# EasyEDA schematic SCH_touch_clock_2022-06-03.json
TITLE: Sheet_1; REV: 1.0; Date: 2021-07-16; Sheet: 1/1; Drawn By: hhzrbq; Company: Your Company
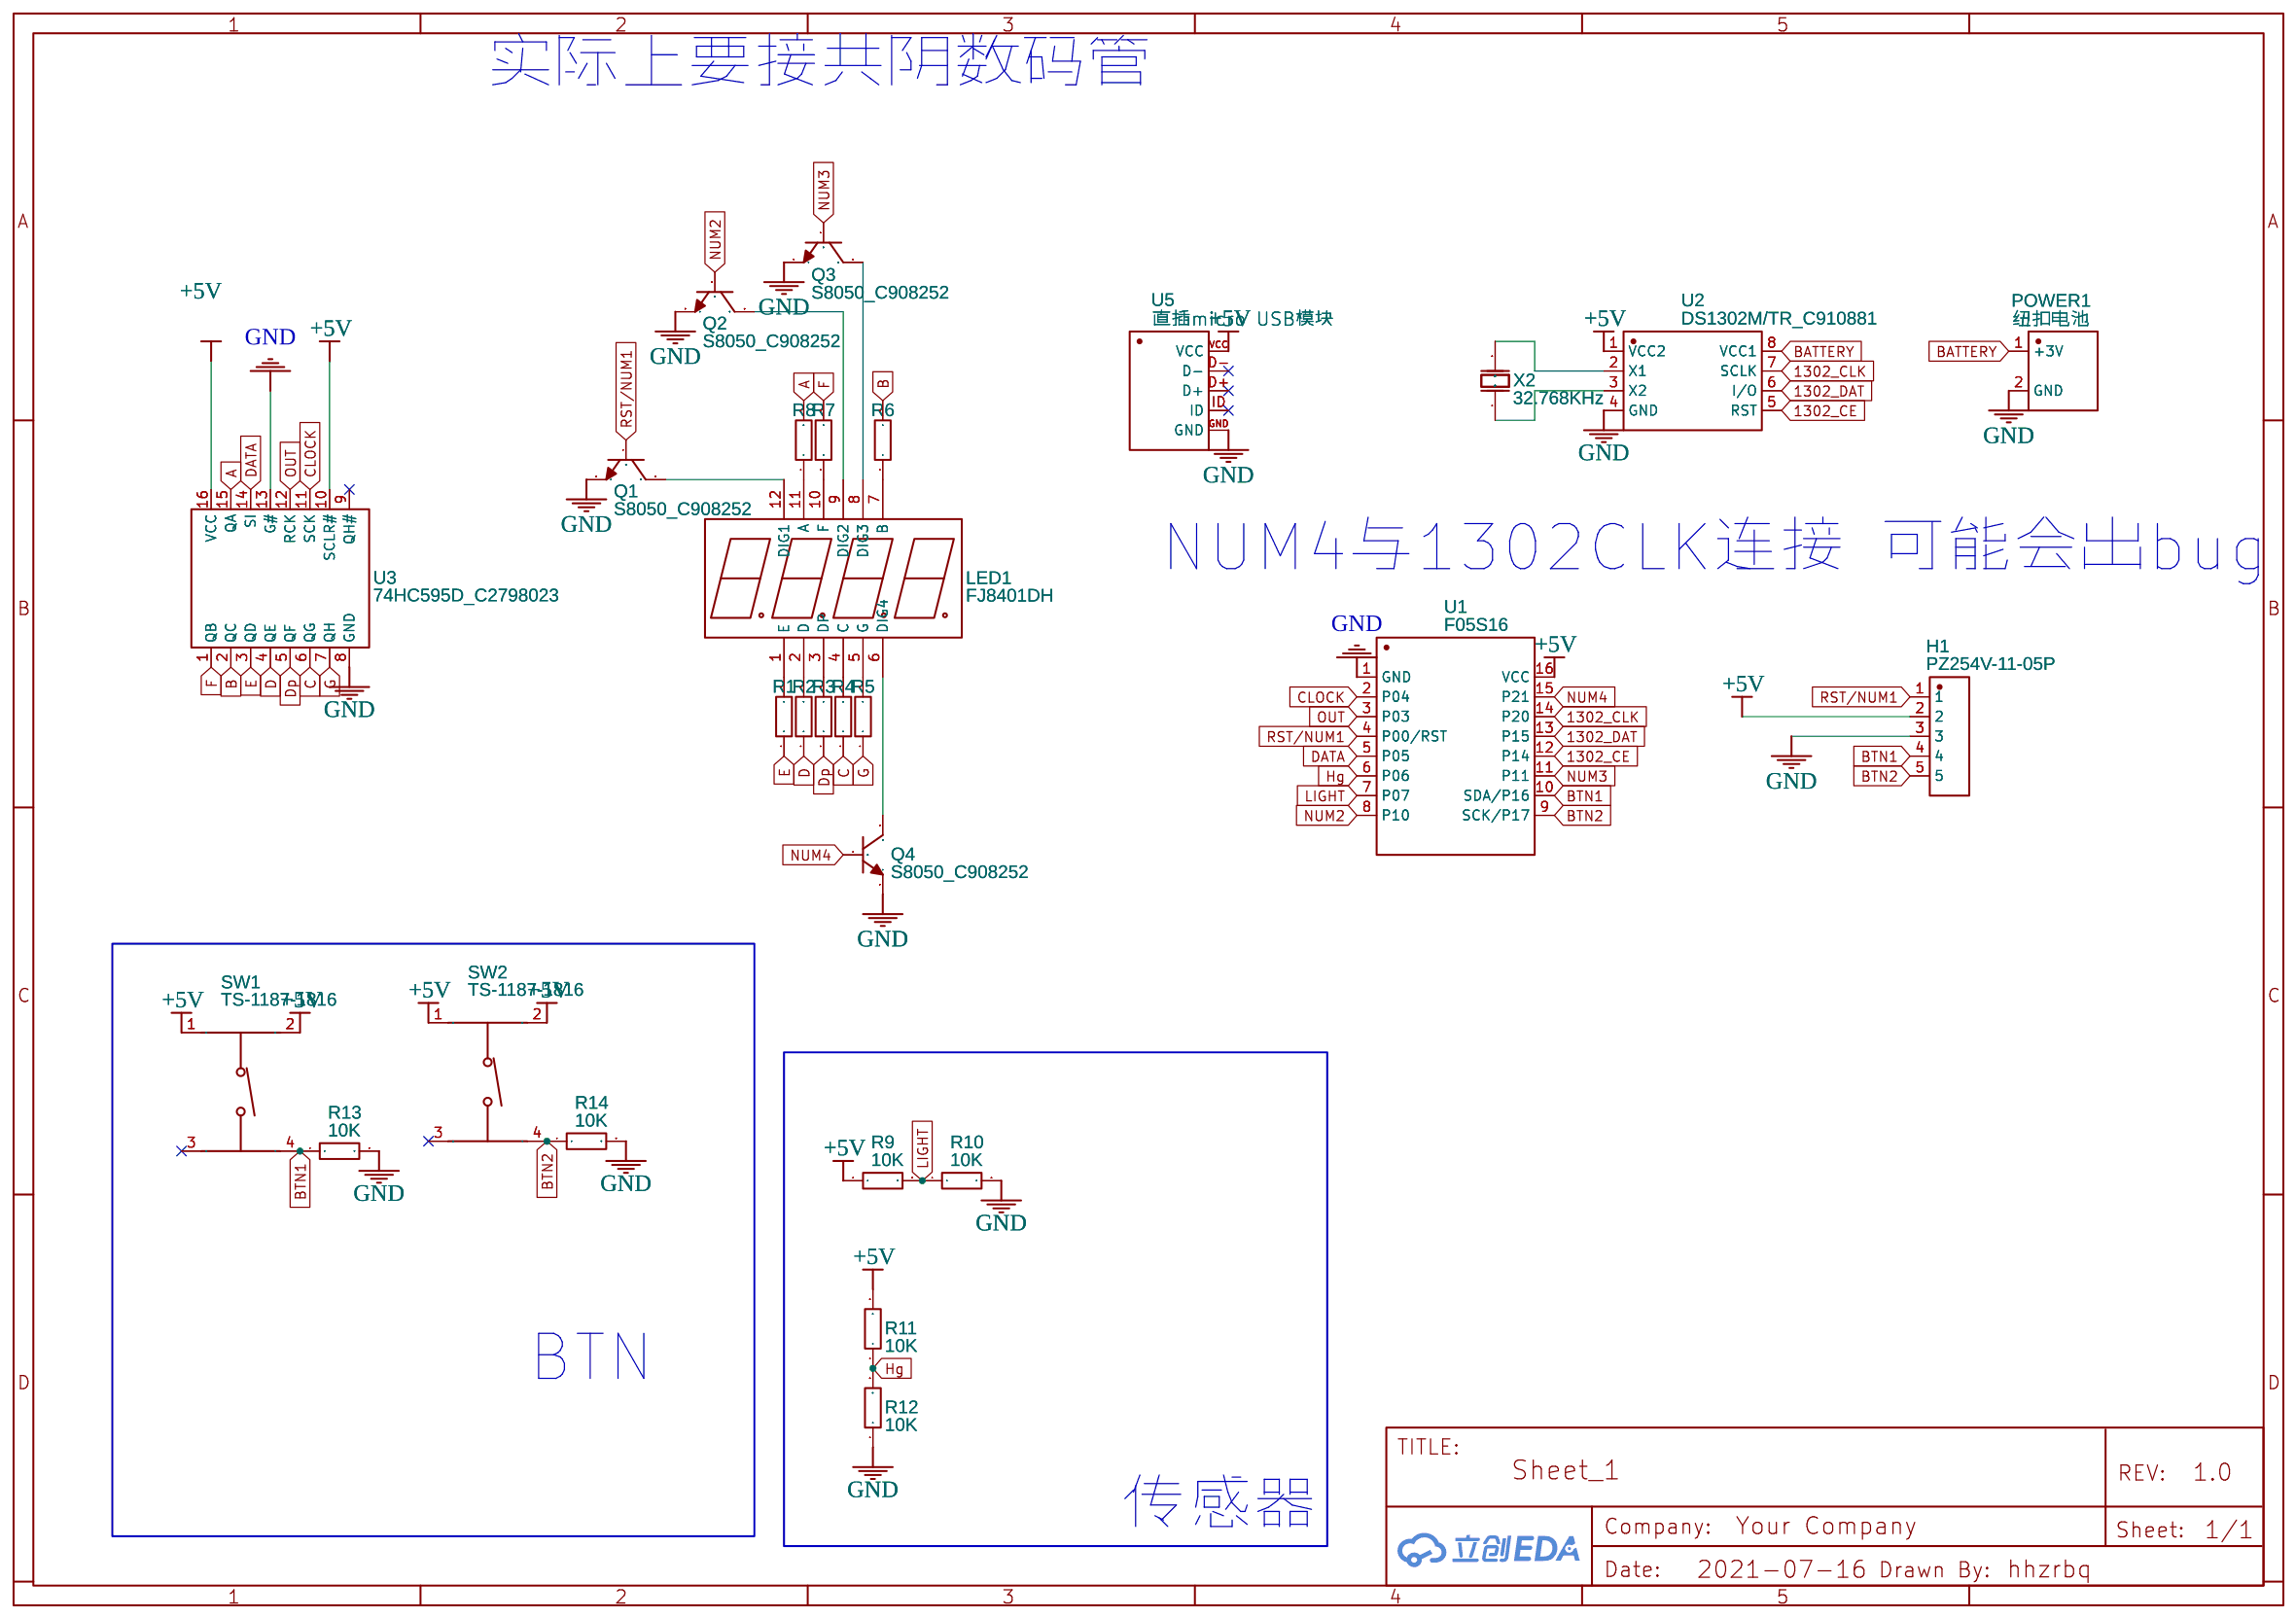
[diagram p0: schematic sheet]

## Parts
H1  PZ254V-11-05P  [HDR-TH_5P-P2.54-V-M]
LED1  FJ8401DH  [LED-SEG-TH_12P-L71.5-W25.7-P2.54-S21.90-TL]
POWER1  纽扣电池  [BTR]
Q1  S8050_C908252  [SOT-23-3_L2.9-W1.3-P1.90-LS2.4-BR]
Q2  S8050_C908252  [SOT-23-3_L2.9-W1.3-P1.90-LS2.4-BR]
Q3  S8050_C908252  [SOT-23-3_L2.9-W1.3-P1.90-LS2.4-BR]
Q4  S8050_C908252  [SOT-23-3_L2.9-W1.3-P1.90-LS2.4-BR]
R1  10K  [R0805]
R2  10K  [R0805]
R3  10K  [R0805]
R4  10K  [R0805]
R5  10K  [R0805]
R6  10K  [R0805]
R7  10K  [R0805]
R8  10K  [R0805]
R9  10K  [R0805]
R10  10K  [R0805]
R11  10K  [R0805]
R12  10K  [R0805]
R13  10K  [R0805]
R14  10K  [R0805]
SW1  TS-1187-1816  [SW-SMD_4P-L5.2-W5.2-P3.70-LS6.4]
SW2  TS-1187-1816  [SW-SMD_4P-L5.2-W5.2-P3.70-LS6.4]
U1  F05S16  [SOP16-LONG_LEG]
U2  DS1302M/TR_C910881  [SOP-8_L4.9-W3.9-P1.27-LS6.0-BL]
U3  74HC595D_C2798023  [SOP-16_L10.0-W3.9-P1.27-LS6.0-BL]
U5  直插micro USB模块  [MICRO USB模块]
X2  32.768KHz  [OSC-TH_BD3.1-P0.8-D0.3]

## Library data of the parts
H1 = PZ254V-11-05P: Supplier: LCSC; Supplier Part: C492404; Manufacturer: XFCN; Contributor: LCSC; JLCPCB Part Class: Extended Part
LED1 = FJ8401DH: Supplier: LCSC; Supplier Part: C70368; Manufacturer: Shenzhen Zhihao Elec; Contributor: LCSC; JLCPCB Part Class: Extended Part
POWER1 = 纽扣电池: Supplier: taobao; Contributor: hhzrbq
Q1-Q4 = S8050_C908252: Supplier: LCSC; Supplier Part: C908252; Manufacturer: FUXINSEMI; Manufacturer Part: S8050; Contributor: LCSC; Paste Type: expand
R1-R14 = RG2012P-103-B-T5: Supplier: LCSC; Supplier Part: C328719; Manufacturer: SUSUMU; Contributor: LCSC
SW1 SW2 = TS-1187-1816: Supplier: LCSC; Supplier Part: C183614; Manufacturer: SOFNG; Contributor: LCSC
U1 = F05S16: Supplier: Sinomicon; Contributor: hhzrbq
U2 = DS1302M/TR_C910881: Supplier: LCSC; Supplier Part: C910881; Manufacturer: HGC(华冠); Manufacturer Part: DS1302M/TR; Contributor: LCSC; JLCPCB Part Class: Extended Part
U3 = 74HC595D_C2798023: Supplier: LCSC; Supplier Part: C2798023; Manufacturer: FM富满; Manufacturer Part: 74HC595D; Contributor: LCSC
U5 = 直插micro USB模块: Supplier: taobao; Contributor: hhzrbq
X2 = AB38T-32.768KHZ: Supplier: LCSC; Supplier Part: C194002; Manufacturer: Abracon LLC; Contributor: LCSC; JLCPCB SMD: Yes; SMT Type: Extend

## Nets
+5V: H1.2 R9.1 R11.2 SW1.1 SW1.2 SW2.1 SW2.2 U1.16(VCC) U2.1(VCC2) U3.10(SCLR#) U3.16(VCC) U5.VCC
GND: H1.3 POWER1.2(GND) Q1.2(E) Q2.2(E) Q3.2(E) Q4.2(E) R10.2 R12.1 R13.2 R14.2 U1.1(GND) U2.4(GND) U3.8(GND) U3.13(G#) U5.GND
1302_CE: U1.12(P14) U2.5(RST)
1302_CLK: U1.14(P20) U2.7(SCLK)
1302_DAT: U1.13(P15) U2.6(I/O)
A: R8.2 U3.15(QA)
B: R6.2 U3.2(QC)
BATTERY: POWER1.1(+3V) U2.8(VCC1)
BTN1: H1.4 R13.1 SW1.4 U1.10(SDA/P16)
BTN2: H1.5 R14.1 SW2.4 U1.9(SCK/P17)
C: R4.1 U3.6(QG)
CLOCK: U1.2(P04) U3.11(SCK)
D: R2.1 U3.4(QE)
DATA: U1.5(P05) U3.14(SI)
Dp: R3.1 U3.5(QF)
E: R1.1 U3.3(QD)
F: R7.2 U3.1(QB)
G: R5.1 U3.7(QH)
Hg: R11.1 R12.2 U1.6(P06)
LIGHT: R9.2 R10.1 U1.7(P07)
NUM2: Q2.1(B) U1.8(P10)
NUM3: Q3.1(B) U1.11(P11)
NUM4: Q4.1(B) U1.15(P21)
OUT: U1.3(P03) U3.12(RCK)
RST/NUM1: H1.1 Q1.1(B) U1.4(P00/RST)
Net-(LED1-1): LED1.1(E) R1.2
Net-(LED1-2): LED1.2(D) R2.2
Net-(LED1-3): LED1.3(DP) R3.2
Net-(LED1-4): LED1.4(C) R4.2
Net-(LED1-5): LED1.5(G) R5.2
Net-(LED1-6): LED1.6(DIG4) Q4.3(C)
Net-(LED1-7): LED1.7(B) R6.1
Net-(LED1-8): LED1.8(DIG3) Q3.3(C)
Net-(LED1-9): LED1.9(DIG2) Q2.3(C)
Net-(LED1-10): LED1.10(F) R7.1
Net-(LED1-11): LED1.11(A) R8.1
Net-(LED1-12): LED1.12(DIG1) Q1.3(C)
Net-(U2-2): U2.2(X1) X2.2(OSC2)
Net-(U2-3): U2.3(X2) X2.1(OSC1)

Not connected (* = marked no-connect by the designer): SW1 3*; SW2 3*; U3 9(QH#)*; U5 D+* D-* ID*

## Notes on the sheet
- 实际上要接共阴数码管
- NUM4与1302CLK连接 可能会出bug
- BTN
- 传感器
